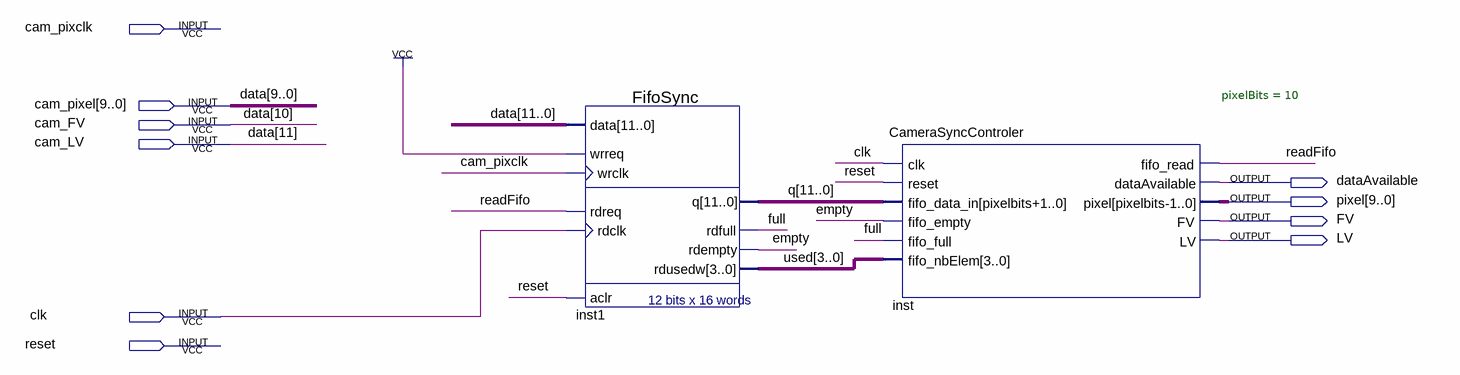
[diagram p0: schematic sheet]
// Quartus schematic CameraSync_block.bdf as structural Verilog: 2 symbols, 10 pins
module CameraSync_block (
  input  cam_pixclk,
  input  [9:0] cam_pixel,
  input  cam_FV,
  input  cam_LV,
  input  clk,
  input  reset,
  output dataAvailable,
  output [9:0] pixel,
  output FV,
  output LV
);

  wire empty, full, readFifo;
  wire [3:0] used;
  wire [11:0] q;

  FifoSync inst1 (
    .data({cam_LV, cam_FV, cam_pixel}), .wrreq(1'b1), .wrclk(cam_pixclk), .rdreq(readFifo), .rdclk(clk),
    .aclr(reset), .q(q), .rdfull(full), .rdempty(empty), .rdusedw(used));
  CameraSyncControler #(.pixelBits(10)) inst (
    .clk(clk), .reset(reset), .fifo_data_in(q), .fifo_empty(empty), .fifo_full(full), .fifo_nbElem(used),
    .fifo_read(readFifo), .dataAvailable(dataAvailable), .pixel(pixel), .FV(FV), .LV(LV));

  // Other names for the same wires on the sheet: data[11:0] = {cam_LV, cam_FV, cam_pixel}
endmodule
